# EAGLE design FishingReelController (EAGLE 6.5.0)
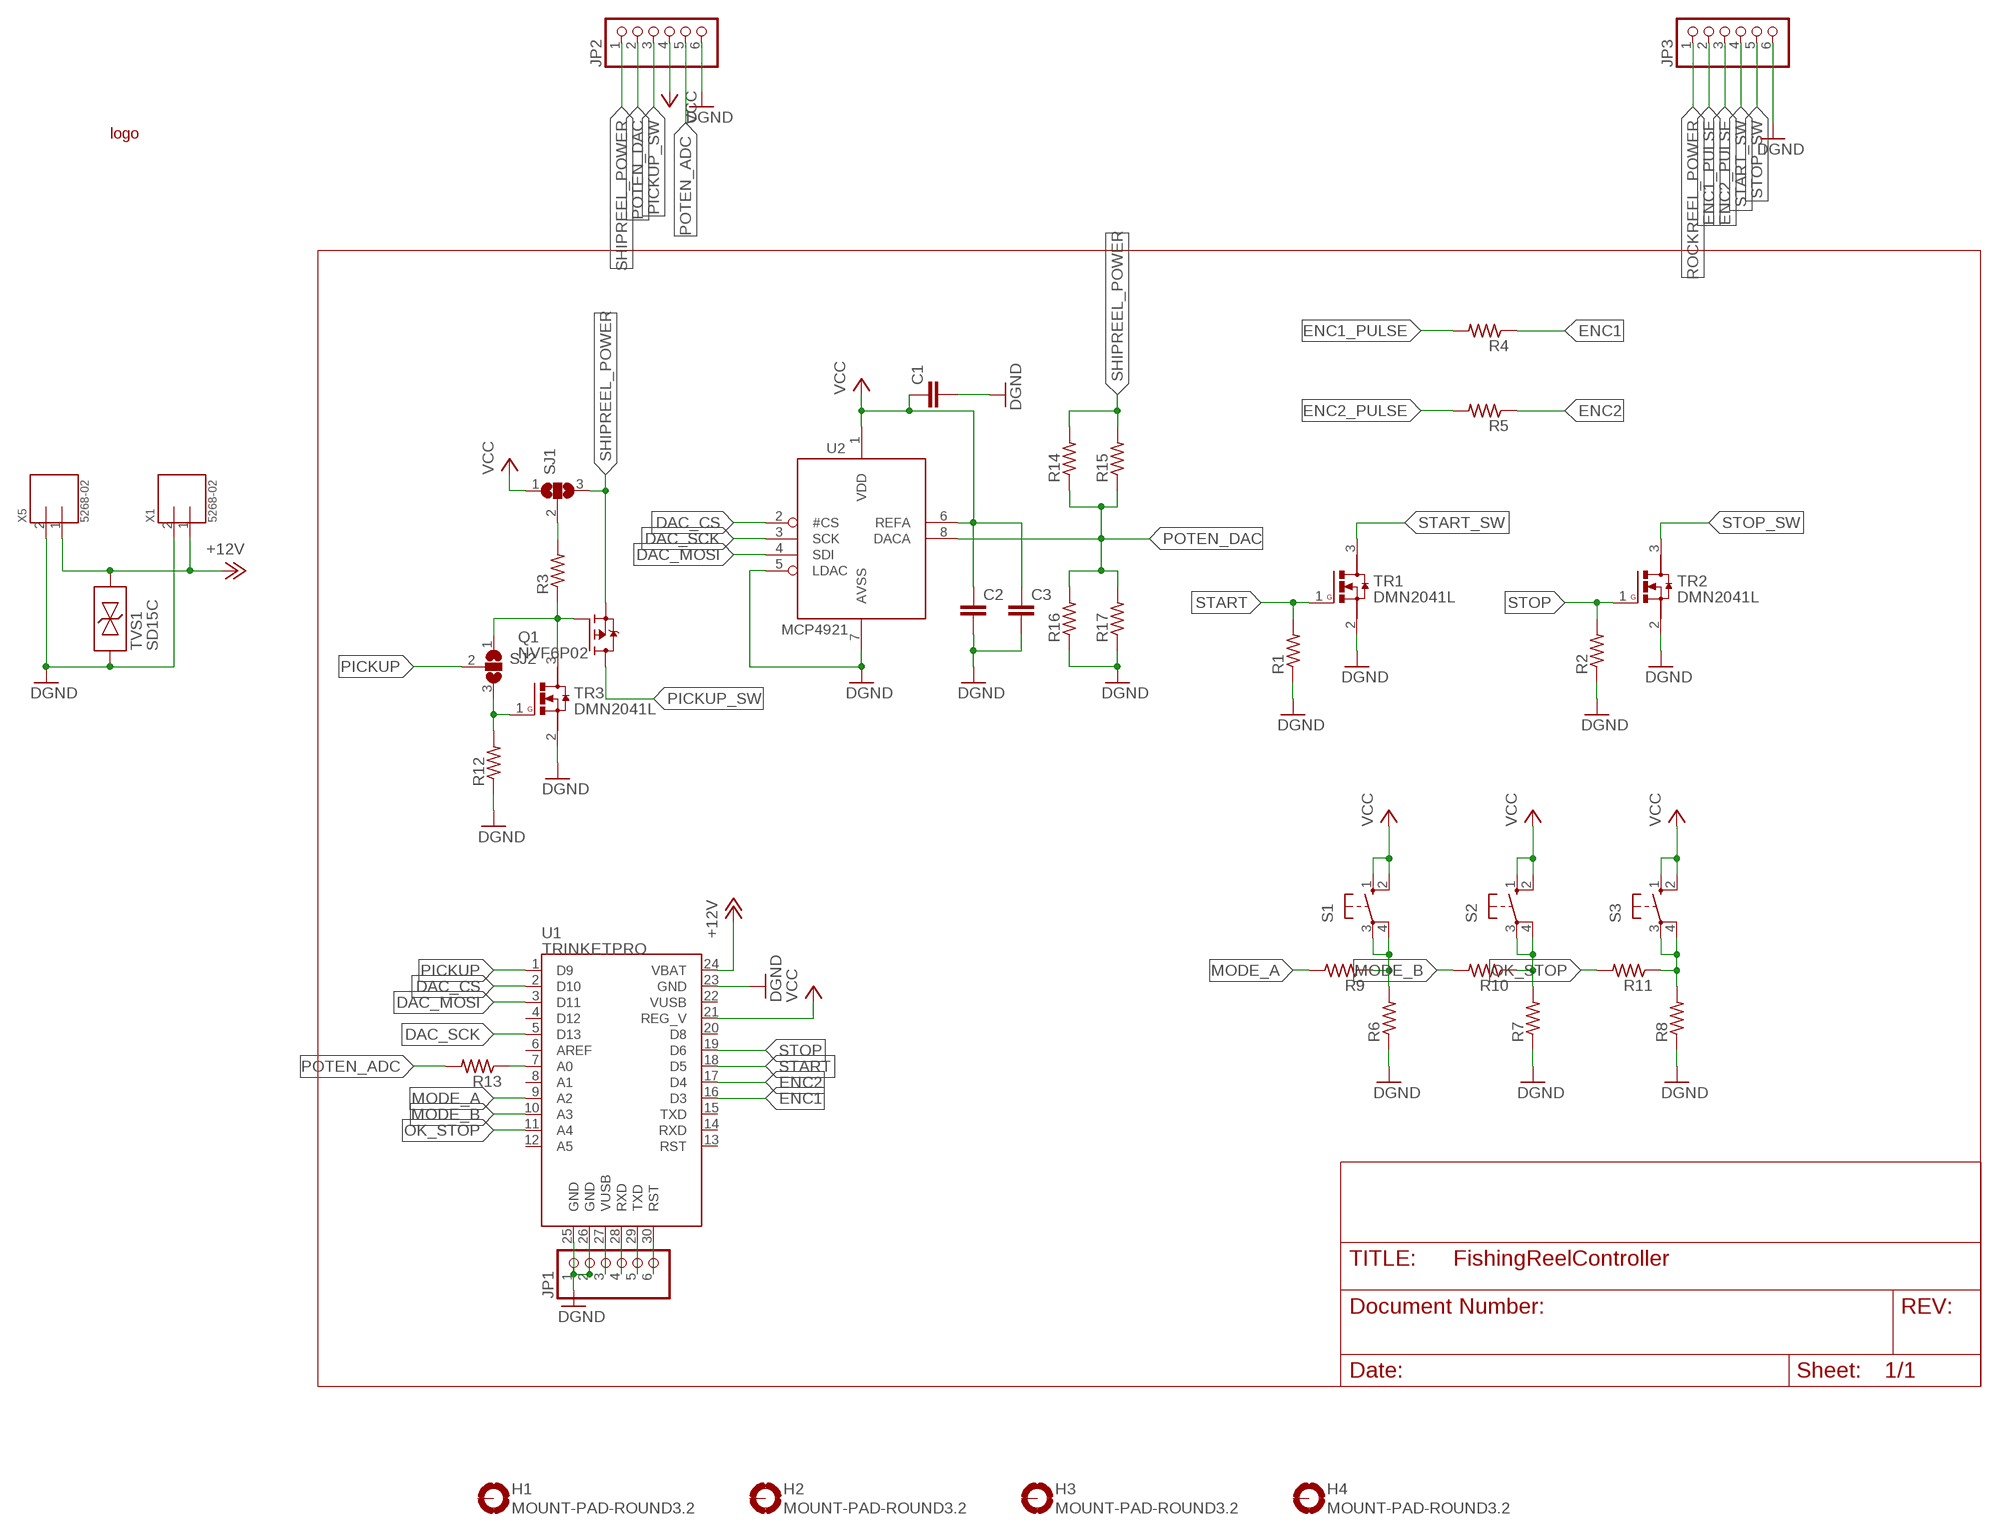
[diagram p0: schematic, sheet 1]

## Parts
C1  C0603(1608)  [C0603(1608)]
C2  C0603(1608)  [C0603(1608)]
C3  C0603(1608)  [C0603(1608)]
H1  MOUNT-PAD-ROUND3.2  [3,2-PAD]
H2  MOUNT-PAD-ROUND3.2  [3,2-PAD]
H3  MOUNT-PAD-ROUND3.2  [3,2-PAD]
H4  MOUNT-PAD-ROUND3.2  [3,2-PAD]
JP1  PINHD-1X6CB  [1X06-CLEANBIG]
JP2  PINHD-1X6CB  [1X06-CLEANBIG]
JP3  PINHD-1X6CB  [1X06-CLEANBIG]
LOGO1  GRADEFREELOGO-20  [GRADEFREELOGO-20]
Q1  NVF6P02  [SOT223]
R1  R0603(1608)  [R0603(1608)]
R2  R0603(1608)  [R0603(1608)]
R3  R0603(1608)  [R0603(1608)]
R4  R0603(1608)  [R0603(1608)]
R5  R0603(1608)  [R0603(1608)]
R6  R0603(1608)  [R0603(1608)]
R7  R0603(1608)  [R0603(1608)]
R8  R0603(1608)  [R0603(1608)]
R9  R0603(1608)  [R0603(1608)]
R10  R0603(1608)  [R0603(1608)]
R11  R0603(1608)  [R0603(1608)]
R12  R0603(1608)  [R0603(1608)]
R13  R0603(1608)  [R0603(1608)]
R14  R0603(1608)  [R0603(1608)]
R15  R0603(1608)  [R0603(1608)]
R16  R0603(1608)  [R0603(1608)]
R17  R0603(1608)  [R0603(1608)]
S1  40-XX  [B3F-40XX]
S2  40-XX  [B3F-40XX]
S3  40-XX  [B3F-40XX]
SJ1  SJ2W  [SJ_2]
SJ2  SJ2W  [SJ_2]
TR1  DMN2041L  [SOT23]
TR2  DMN2041L  [SOT23]
TR3  DMN2041L  [SOT23]
TVS1  SD15C  SD0  [SOD-323-NOPOL]
U1  TRINKETPRO  [TRINKETPRO]
U2  MCP4921  [DIL08]
X1  5268-02  [5628-02]
X5  5268-02  [5628-02]

## Nets
+12V: TVS1.2 U1.24(VBAT) X1.1 X5.1
DAC_CS: U1.2(D10) U2.2(#CS)
DAC_MOSI: U1.3(D11) U2.4(SDI)
DAC_SCK: U1.5(D13) U2.3(SCK)
DGND: C1.2 C2.2 C3.2 JP1.1 JP1.2 JP2.6 JP3.6 R1.1 R2.1 R6.1 R7.1 R8.1 R12.1 R16.1 R17.1 TR1.2(S) TR2.2(S) TR3.2(S) TVS1.1 U1.23(GND) U1.25(GND) U1.26(GND) U2.5(LDAC) U2.7(AVSS) X1.2 X5.2
ENC1: R4.1 U1.16(D3)
ENC1_PULSE: JP3.2 R4.2
ENC2: R5.1 U1.17(D4)
ENC2_PULSE: JP3.3 R5.2
MODE_A: R9.2 U1.9(A2)
MODE_B: R10.2 U1.10(A3)
N$1: R12.2 SJ2.3 TR3.1(G)
N$2: JP1.3 U1.27(VUSB)
N$3: JP1.4 U1.28(RXD)
N$4: JP1.5 U1.29(TXD)
N$5: JP1.6 U1.30(RST)
N$6: Q1.1(G) R3.1 SJ2.1 TR3.3(D)
N$7: R13.1 U1.7(A0)
N$11: R3.2 SJ1.2
N$16: R6.2 R9.1 S1.3(P) S1.4(P1)
N$17: R7.2 R10.1 S2.3(P) S2.4(P1)
N$18: R8.2 R11.1 S3.3(P) S3.4(P1)
OK_STOP: R11.2 U1.11(A4)
PICKUP: SJ2.2 U1.1(D9)
PICKUP_SW: JP2.3 Q1.2(D) Q1.4(D)
POTEN_ADC: JP2.5 R13.2
POTEN_DAC: JP2.2 R14.1 R15.1 R16.2 R17.2 U2.8(DACA)
ROCKREEL_POWER: JP3.1
SHIPREEL_POWER: JP2.1 Q1.3(S) R14.2 R15.2 SJ1.3
START: R1.2 TR1.1(G) U1.18(D5)
START_SW: JP3.4 TR1.3(D)
STOP: R2.2 TR2.1(G) U1.19(D6)
STOP_SW: JP3.5 TR2.3(D)
VCC: C1.1 C2.1 C3.1 JP2.4 S1.1(S) S1.2(S1) S2.1(S) S2.2(S1) S3.1(S) S3.2(S1) SJ1.1 U1.21(REG_V) U2.1(VDD) U2.6(REFA)
Unconnected: H1.B3,2(MOUNT) H2.B3,2(MOUNT) H3.B3,2(MOUNT) H4.B3,2(MOUNT) U1.4(D12) U1.6(AREF) U1.8(A1) U1.12(A5) U1.13(RST) U1.14(RXD) U1.15(TXD) U1.20(D8) U1.22(VUSB)

## Library data of the parts
C1-C3 = GradeFreeEngineer:C
H1-H4 = berry:MOUNT-PAD-ROUND: MOUNTING PAD, round
JP1-JP3 = adafruit:PINHD-1X6: PIN HEADER
LOGO1 = GradeFreeEngineer:GRADEFREELOGO
Q1 = GradeFreeEngineer:NVF6P02
R1-R17 = GradeFreeEngineer:R
S1-S3 = GradeFreeEngineer:40-XX: OMRON SWITCH; MF: OMRON COMPONENTS USA; MPN: B3F-4000; OC_FARNELL: 176434; OC_NEWARK: 36K3105
SJ1 SJ2 = jumper:SJ2W: SMD solder JUMPER
TR1-TR3 = GradeFreeEngineer:DMN2041L
TVS1 = berry:SD0: semtech TVS diode SD05C - 5V version SD12C - 12V version
U1 = GradeFreeEngineer:TRINKETPRO
U2 = GradeFreeEngineer:MCP4921
X1 X5 = OSSI:5268-02

## Board
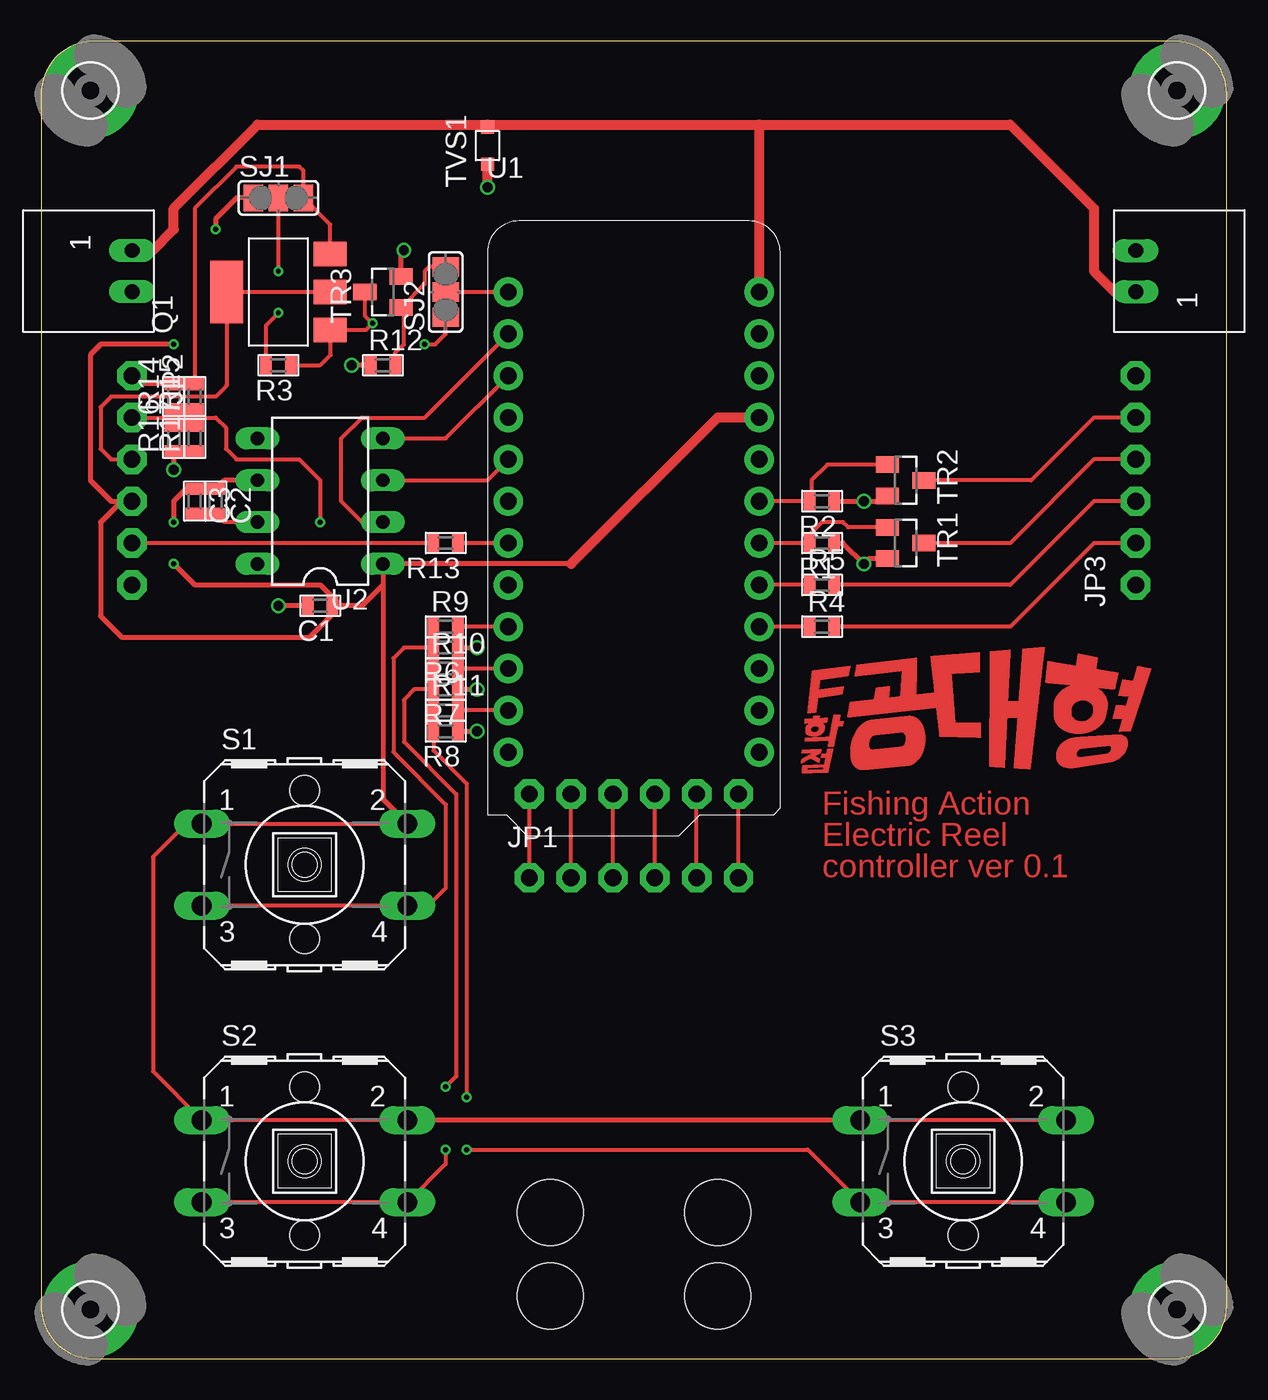
[diagram p1: board, top side]
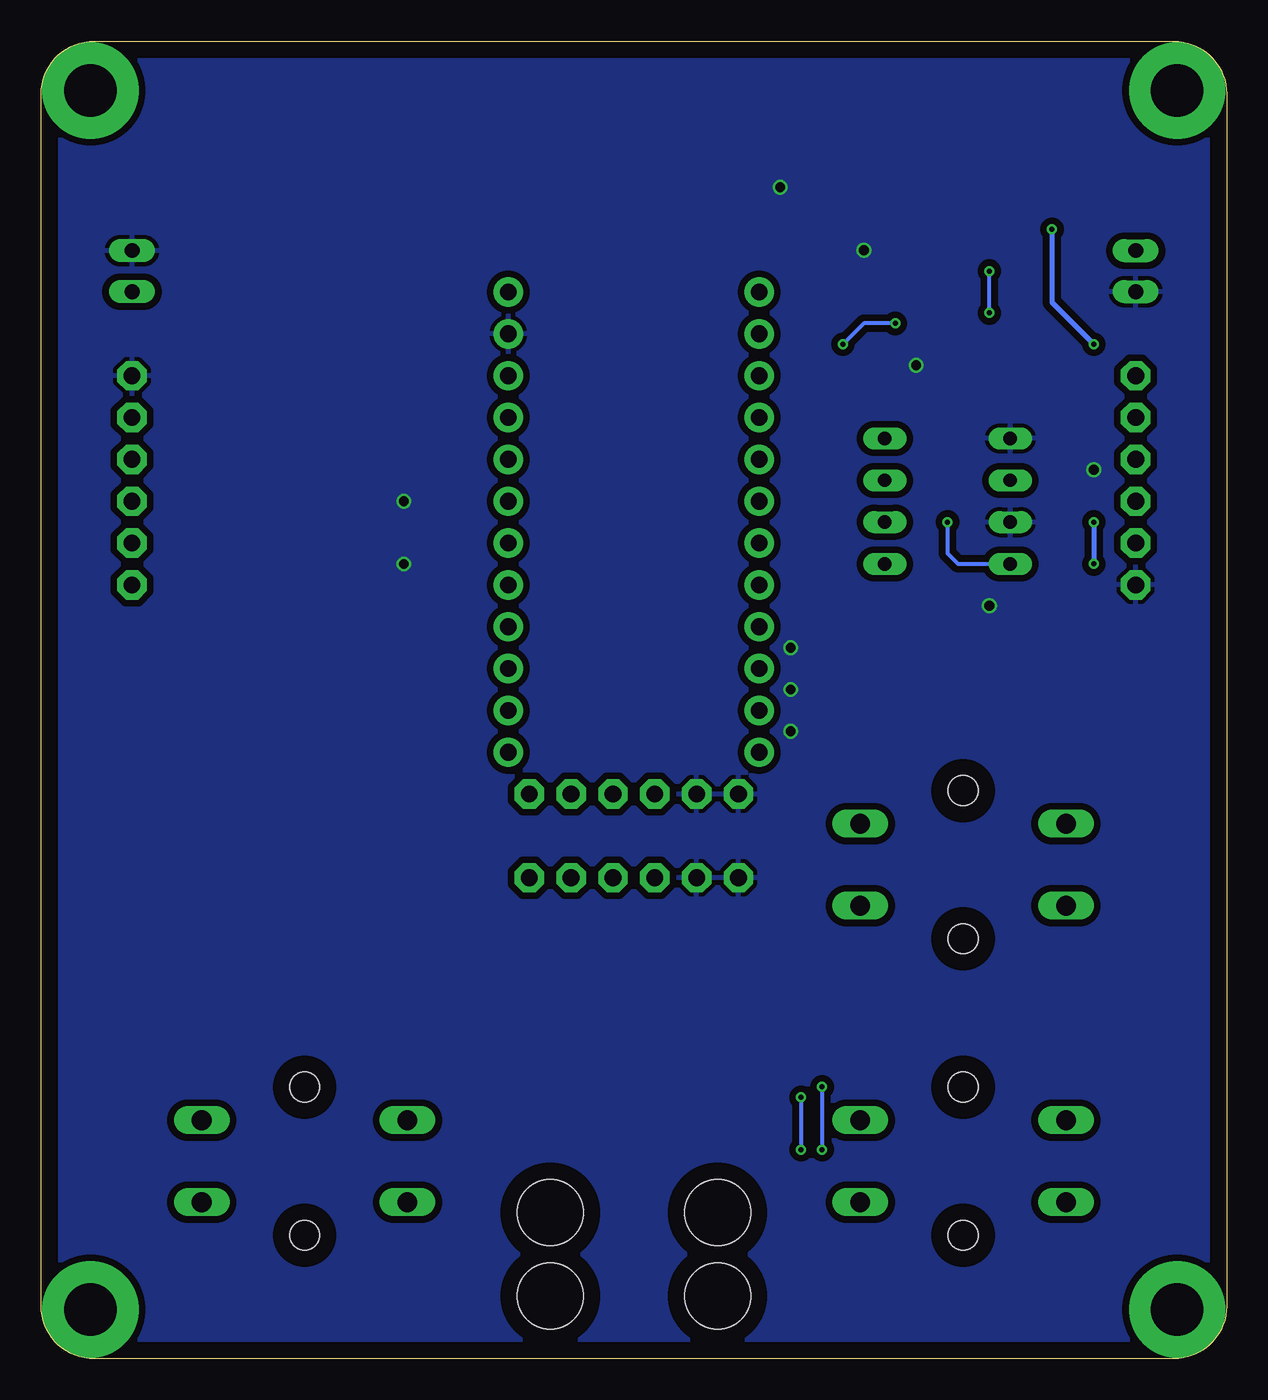
[diagram p2: board, bottom side, seen from below]

Size 72 x 80 mm. Coordinates in mm from the lower left corner, seen from the top.
Outline: 0,76.8 0,3.2 arc90 3.2,0 68.8,0 arc90 72,3.2 72,76.8 arc90 68.8,80 3.2,80 arc90 0,76.8
Copper layers (1*16): Top 0.035mm / dielectric 1.5mm / Bottom 0.035mm
Design rules "hsdgt": minimum track width 6mil, minimum drill 8mil, track to track 6mil, track to pad 6mil, pad to pad 6mil, via to via 6mil, smd to smd 6mil, copper to edge 40mil, drill to drill 8mil, minimum pad ring 10mil, minimum via ring 6mil, stop-mask expansion 4mil, vias tented up to drill 0mil, thermal gap 10mil
Holes 4 mm at 30.92,3.81 41.08,3.81 41.08,8.89 30.92,8.89

### Footprints (pad centres in the part's own frame; a part is rotated, then mirrored left to right if it is on the bottom)
C0603(1608) = smd 0.7 x 1.1: 1 -0.75,0; 2 0.75,0
3,2-PAD = drill 3.2 pad 5.842: B3,2 0,0
1X06-CLEANBIG = drill 1.016 pad 1.778 octagon: 1 -6.35,0; 2 -3.81,0; 3 -1.27,0; 4 1.27,0; 5 3.81,0; 6 6.35,0
SOT223 = smd 1.5 x 2: 1 -2.3,-3.15; 2 0,-3.15; 3 2.3,-3.15 | smd 3.8 x 2: 4 0,3.15
R0603(1608) = smd 0.7 x 1.1: 1 -0.75,0; 2 0.75,0
B3F-40XX = drill 1.194 long: 1 -6.248,2.489; 2 6.248,2.489; 3 -6.248,-2.489; 4 6.248,-2.489 | hole 1.803: 0,-4.496; 0,4.496
SJ_2 = smd 1.168 x 1.6: 1 -1.524,0; 2 0,0; 3 1.524,0
SOT23 = smd 1 x 1.4: 1 -0.95,-1.1; 2 0.95,-1.1; 3 0,1.1
SOD-323-NOPOL = smd 0.8 x 0.8: 1 -1.125,0; 2 1.125,0
TRINKETPRO = drill 1.016 pad 1.778: 1 -7.62,13.97; 2 -7.62,11.43; 3 -7.62,8.89; 4 -7.62,6.35; 5 -7.62,3.81; 6 -7.62,1.27; 7 -7.62,-1.27; 8 -7.62,-3.81; 9 -7.62,-6.35; 10 -7.62,-8.89; 11 -7.62,-11.43; 12 -7.62,-13.97; 13 7.62,-13.97; 14 7.62,-11.43; 15 7.62,-8.89; 16 7.62,-6.35; 17 7.62,-3.81; 18 7.62,-1.27; 19 7.62,1.27; 20 7.62,3.81; 21 7.62,6.35; 22 7.62,8.89; 23 7.62,11.43; 24 7.62,13.97 | drill 1.016 pad 1.778 octagon: 25 -6.35,-16.51; 26 -3.81,-16.51; 27 -1.27,-16.51; 28 1.27,-16.51; 29 3.81,-16.51; 30 6.35,-16.51
DIL08 = drill 0.813 long: 1 -3.81,-3.81; 2 -1.27,-3.81; 3 1.27,-3.81; 4 3.81,-3.81; 5 3.81,3.81; 6 1.27,3.81; 7 -1.27,3.81; 8 -3.81,3.81
5628-02 = drill 0.9 long: 1 1.25,0; 2 -1.25,0

### Placement (x,y rotation side)
C1  16.95,45.72 180 top
C2  10.6,52.07 270 top
C3  9.33,52.07 270 top
H1  3,77 0 top
H2  69,77 0 top
H3  3,3 0 top
H4  69,3 0 top
JP1  36,29.21 0 top
JP2  5.52,53.34 270 top
JP3  66.48,53.34 90 top
LOGO1  46.16,35.56 0 top
Q1  14.41,64.77 90 top
R1  47.43,49.53 180 top
R2  47.43,52.07 180 top
R3  14.41,60.33 180 top
R4  47.43,44.45 0 top
R5  47.43,46.99 0 top
R6  24.57,43.18 180 top
R7  24.57,40.64 180 top
R8  24.57,38.1 180 top
R9  24.57,44.45 0 top
R10  24.57,41.91 0 top
R11  24.57,39.37 0 top
R12  20.76,60.33 0 top
R13  24.57,49.53 180 top
R14  8.06,58.42 90 top
R15  9.33,58.42 90 top
R16  8.06,55.88 90 top
R17  9.33,55.88 90 top
S1  16,30 0 top
S2  16,12 0 top
S3  56,12 0 top
SJ1  14.41,70.48 0 top
SJ2  24.57,64.77 90 top
TR1  52.51,49.53 270 top
TR2  52.51,53.34 270 top
TR3  20.76,64.77 90 top
TVS1  27.11,73.66 90 top
U1  36,50.8 0 top
U2  16.95,52.07 90 top
X1  5.52,66.04 90 top
X5  66.48,66.04 270 top

### Tracks (layer width: path | path; a pad name or v marks a point on that pad's centre or on a via)
+12V
  Top 0.61: X1.1 6.77,67.29 8.06,68.58 8.06,69.85 13.14,74.93 27.11,74.93 | 27.11,74.93 43.62,74.93 | 43.62,74.93 58.86,74.93 63.94,69.85 63.94,66.04 65.21,64.77 66.46,64.77 X5.1 | U1.24 43.62,74.93 | TVS1.2 27.11,74.93
DAC_CS
  Top 0.254: U2.2 19.49,50.8 18.22,52.07 18.22,55.88 19.49,57.15 23.3,57.15 U1.2
DAC_MOSI
  Top 0.254: U2.4 24.57,55.88 U1.3
DAC_SCK
  Top 0.254: U2.3 27.11,53.34 U1.5
DGND  (via drill 0.6)
  Top 0.254: JP1.1 U1.25 | JP1.2 U1.26 | U2.7 11.12,50.8 C2.2 C3.2
  Top 0.305: R2.1 v49.97,52.07 51.09,52.07 TR2.2 | TR1.2 50.29,48.58 v49.97,48.26 48.7,49.53 R1.1 | R17.1 R16.1 v8.06,53.98 | C1.2 v14.41,45.72 | R12.1 v18.86,60.33 | TR3.2 21.86,67.14 v22.03,67.31 | R6.1 v26.48,43.18 | R7.1 v26.48,40.64 | R8.1 v26.48,38.1
  Top 0.61: v27.11,71.12 TVS1.1
  pour Bottom (isolate 0.406): 0.44,80.01 71.56,80.01 71.56,0 0.44,0
ENC1
  Top 0.254: R4.1 U1.16
ENC1_PULSE
  Top 0.254: JP3.2 63.94,49.53 58.86,44.45 R4.2
ENC2
  Top 0.254: R5.1 U1.17
ENC2_PULSE
  Top 0.254: JP3.3 63.94,52.07 58.86,46.99 R5.2
MODE_A
  Top 0.254: U1.9 R9.2
MODE_B
  Top 0.254: U1.10 R10.2
N$1
  Top 0.254: SJ2.3 23.55,66.29 23.3,66.04 23.3,65.26 TR3.1 22.03,63.65 22.03,61.59 21.51,61.08 R12.2
N$2
  Top 0.254: JP1.3 U1.27
N$3
  Top 0.254: JP1.4 U1.28
N$4
  Top 0.254: JP1.5 U1.29
N$5
  Top 0.254: JP1.6 U1.30
N$6  (via drill 0.3)
  Top 0.254: TR3.3 19.66,63.33 v20.12,62.87 19.73,62.47 Q1.1 17.59,62.45 17.59,60.96 16.95,60.33 R3.1 | v23.3,61.59 23.94,61.59 24.57,62.23 SJ2.1
  Bottom 0.254: v20.12,62.87 22.03,62.87 v23.3,61.59
N$7
  Top 0.254: U1.7 R13.1
N$11  (via drill 0.3)
  Top 0.254: R3.2 13.66,62.75 v14.41,63.5 | v14.41,66.04 SJ1.2
  Bottom 0.254: v14.41,63.5 v14.41,66.04
N$16
  Top 0.254: R9.1 R6.2 22.03,43.18 21.39,42.55 21.39,36.83 24.57,33.66 24.57,28.57 23.51,27.51 S1.4 S1.3
N$17  (via drill 0.3)
  Top 0.254: R10.1 R7.2 22.66,40.64 22.03,40.01 22.03,37.47 25.2,34.29 25.2,17.14 v24.57,16.51 | v24.57,12.7 24.57,11.83 S2.4 S2.3
  Bottom 0.254: v24.57,16.51 v24.57,12.7
N$18  (via drill 0.3)
  Top 0.254: R11.1 R8.2 23.82,36.95 25.84,34.92 v25.84,15.88 | v25.84,12.7 46.56,12.7 S3.3 S3.4
  Bottom 0.254: v25.84,15.88 v25.84,12.7
OK_STOP
  Top 0.254: U1.11 R11.2
PICKUP
  Top 0.254: U1.1 SJ2.2
PICKUP_SW
  Top 0.254: Q1.2 Q1.4 11.26,59.08 10.6,58.42 4.25,58.42 3.62,57.78 3.62,55.24 4.25,54.61 JP2.3
POTEN_ADC
  Top 0.254: R13.2 JP2.5
POTEN_DAC  (via drill 0.3)
  Top 0.254: JP2.2 8.06,57.15 | 8.06,57.15 9.33,57.15 | 9.33,57.15 10.6,57.15 11.23,56.52 11.23,55.24 11.87,54.61 15.68,54.61 16.95,53.34 v16.95,50.8 | R15.1 9.33,57.15 | R14.1 8.06,57.15 | R16.2 8.06,57.15 | R17.2 9.33,57.15
  Bottom 0.254: v16.95,50.8 16.95,48.9 16.32,48.26 U2.8
SHIPREEL_POWER
  Top 0.254: Q1.3 17.56,68.86 SJ1.3 15.93,72.14 15.68,72.39 11.87,72.39 9.33,69.85 R15.2 R14.2 6.04,59.17 JP2.1
START
  Top 0.254: U1.18 R1.2 46.8,49.65 46.8,50.16 47.43,50.8 48.7,50.8 49.02,50.48 TR1.1
START_SW
  Top 0.254: JP3.4 63.94,54.61 58.86,49.53 TR1.3
STOP
  Top 0.254: U1.19 R2.2 46.8,52.19 46.8,53.34 47.74,54.29 TR2.1
STOP_SW
  Top 0.254: JP3.5 63.94,57.15 60.13,53.34 TR2.3
VCC  (via drill 0.3)
  Top 0.254: S3.2 48.7,14.49 | S2.2 S2.1 6.79,17.45 6.79,30.48 8.8,32.49 S1.1 S1.2
  Top 0.305: 32.19,48.26 U2.1 | U2.1 20.76,33.98 S1.2 | S3.1 48.7,14.49 S2.2 | U2.1 20.76,46.99 19.49,45.72 18.22,45.72 | 18.22,45.72 C1.1 17.59,45.6 17.59,45.09 16.32,43.81 4.89,43.81 3.62,45.09 3.62,50.8 4.89,52.07 JP2.4 4.25,52.07 2.98,53.34 2.98,60.96 3.62,61.59 v8.06,61.59 | U2.6 11.12,53.34 C2.1 C3.1 8.81,52.82 8.06,52.07 v8.06,50.8 | SJ1.1 11.87,70.48 10.6,69.22 v10.6,68.58 | v8.06,48.26 9.33,46.99 16.95,46.99 18.22,45.72
  Top 0.61: U1.21 41.08,57.15 32.19,48.26
  Bottom 0.305: v10.6,68.58 10.6,64.14 v8.06,61.59 | v8.06,50.8 v8.06,48.26

### Text on the board
Top: Fishing Action | Electric Reel | controller ver 0.1
tStop: Fishing Action | Electric Reel | controller ver 0.1